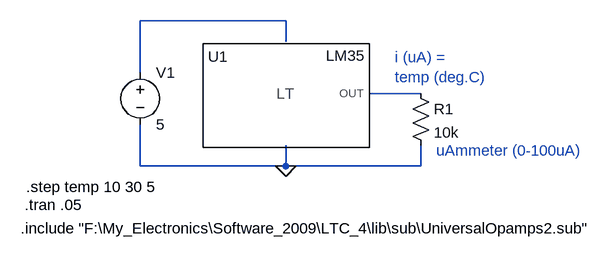
[diagram p0: schematic LM35_using_my_model.asc]
LM35_using_my_model.asc, the LTspice schematic file:
Version 4
SHEET 1 880 680
WIRE 256 32 32 32
WIRE 256 64 256 32
WIRE 32 112 32 32
WIRE 464 144 384 144
WIRE 32 256 32 192
WIRE 256 256 256 224
WIRE 256 256 32 256
WIRE 464 256 464 224
WIRE 464 256 256 256
FLAG 256 256 0
SYMBOL voltage 32 96 R0
WINDOW 123 0 0 Left 0
WINDOW 39 0 0 Left 0
SYMATTR InstName V1
SYMATTR Value 5
SYMBOL LM35 256 144 R0
SYMATTR InstName U1
SYMBOL res 448 128 R0
SYMATTR InstName R1
SYMATTR Value 10k
TEXT -144 288 Left 0 !.step temp 10 30 5
TEXT -146 316 Left 0 !.tran .05
TEXT -152 352 Left 0 !.include "F:\\My_Electronics\\Software_2009\\LTC_4\\lib\\sub\\UniversalOpamps2.sub"
TEXT 424 88 Left 0 ;i (uA) =\ntemp (deg.C)
TEXT 488 232 Left 0 ;uAmmeter (0-100uA)

The netlist it stands for:
* LM35_using_my_model.asc
V1 N001 0 5
XU1 N002 N001 0 LM35  ; pins OUT v+ v-
R1 N002 0 10k
.step temp 10 30 5
.tran .05
.include "F:\My_Electronics\Software_2009\LTC_4\lib\sub\UniversalOpamps2.sub"
* i (uA) =
* temp (deg.C)
* uAmmeter (0-100uA)
.lib LM35_my_model.lib
.backanno
.end